# EAGLE design NU32 (EAGLE 5.12)
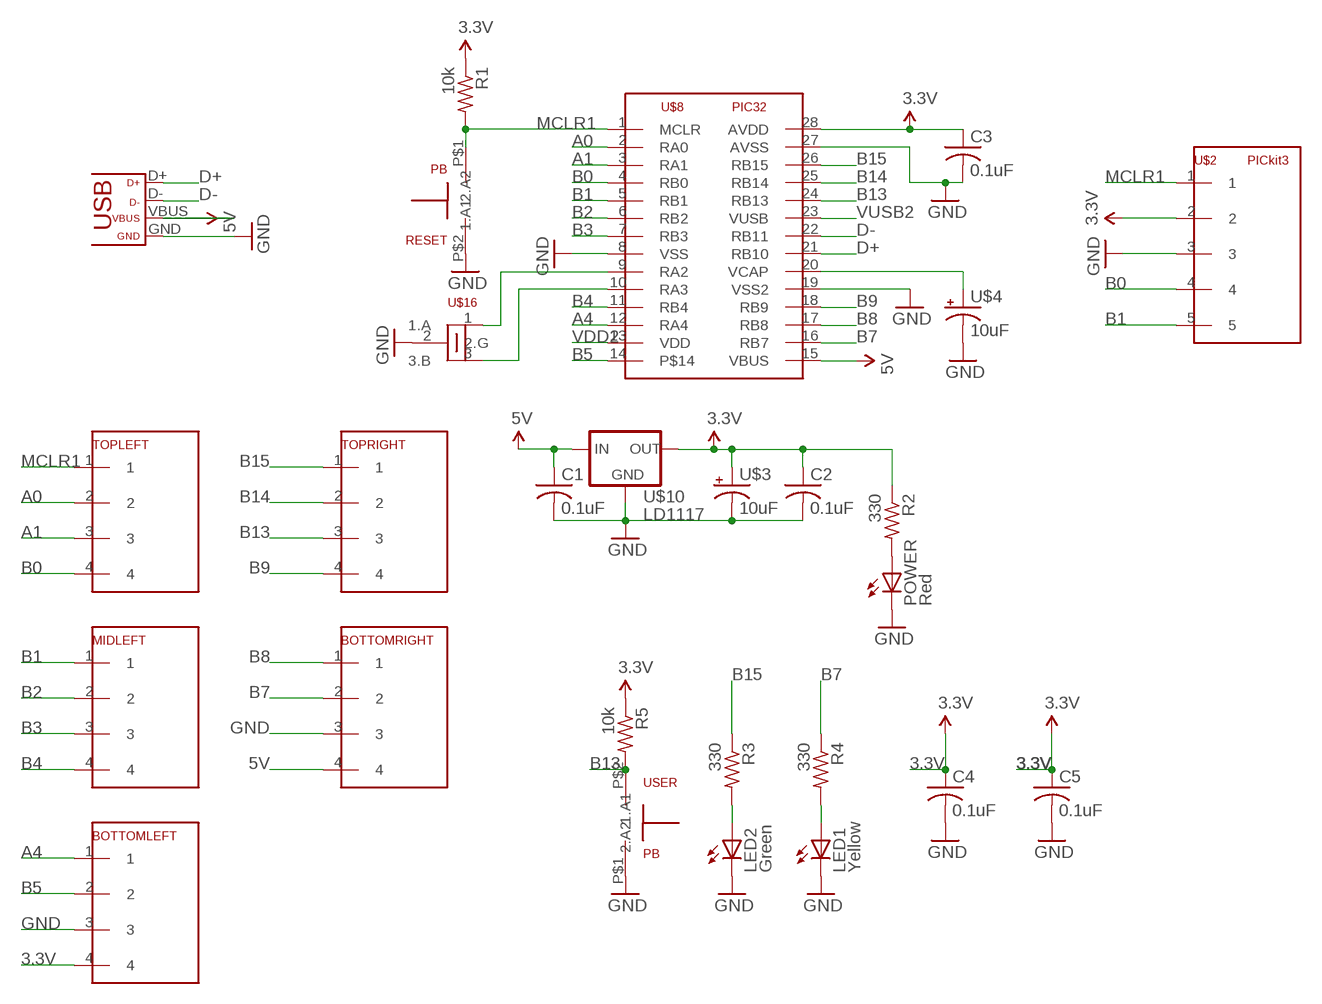
[diagram p0: schematic, sheet 1]

## Parts
BOTTOMLEFT  1X04_HEADER  [1X04]
BOTTOMRIGHT  1X04_HEADER  [1X04]
C1  0.1uF  C-US025-025X050  [C025-025X050]
C2  0.1uF  C-US025-025X050  [C025-025X050]
C3  0.1uF  C-US025-025X050  [C025-025X050]
C4  0.1uF  C-US025-025X050  [C025-025X050]
C5  0.1uF  C-US025-025X050  [C025-025X050]
LED1  Yellow  TLLY4400  [LED3MM]
LED2  Green  TLLG4400  [LED3MM]
MIDLEFT  1X04_HEADER  [1X04]
POWER  Red  TLLR4400  [LED3MM]
R1  10k  R-US_0309/12  [0309/12]
R2  330  R-US_0309/12  [0309/12]
R3  330  R-US_0309/12  [0309/12]
R4  330  R-US_0309/12  [0309/12]
R5  10k  R-US_0309/12  [0309/12]
RESET  PB  [PB]
TOPLEFT  1X04_HEADER  [1X04]
TOPRIGHT  1X04_HEADER  [1X04]
U$2  PICkit3  1X05_HEADER  [1X05]
U$3  10uF  CAP_POL  [CAP_POL_D]
U$4  10uF  CAP_POL  [CAP_POL_D]
U$8  PIC32  [DIL28-3]
U$10  LD1117  [TO220]
U$11  USB  [USB-MINIB]
U$16  8MHz  8MHZ  [1X03]
USER  PB  [PB]

## Nets
3.3V: BOTTOMLEFT.4 C3.1 C4.1 C5.1 R1.1 R5.1 U$2.2 U$8.28(AVDD)
5V: BOTTOMRIGHT.4 U$8.15(VBUS) U$11.VBUS
A0: TOPLEFT.2 U$8.2(RA0)
A1: TOPLEFT.3 U$8.3(RA1)
A4: BOTTOMLEFT.1 U$8.12(RA4)
B0: TOPLEFT.4 U$2.4 U$8.4(RB0)
B1: MIDLEFT.1 U$2.5 U$8.5(RB1)
B2: MIDLEFT.2 U$8.6(RB2)
B3: MIDLEFT.3 U$8.7(RB3)
B4: MIDLEFT.4 U$8.11(RB4)
B5: BOTTOMLEFT.2 U$8.14
B7: BOTTOMRIGHT.2 R4.1 U$8.16(RB7)
B8: BOTTOMRIGHT.1 U$8.17(RB8)
B9: TOPRIGHT.4 U$8.18(RB9)
B13: R5.2 TOPRIGHT.3 U$8.24(RB13) USER.P$2(2.A2)
B14: TOPRIGHT.2 U$8.25(RB14)
B15: R3.1 TOPRIGHT.1 U$8.26(RB15)
C1: C1.1 U$10.3(IN) ; supply symbol labelled 5V
C2: C2.1 R2.1 U$3.1(+) U$10.2(OUT) ; supply symbol labelled 3.3V
D+: U$8.21(RB10) U$11.D+
D-: U$8.22(RB11) U$11.D-
GND: BOTTOMLEFT.3 BOTTOMRIGHT.3 C1.2 C2.2 C3.2 C4.2 C5.2 LED1.K(C) LED2.K(C) POWER.K(C) RESET.P$2(2.A2) U$2.3 U$3.2(-) U$4.2(-) U$8.8(VSS) U$8.19(VSS2) U$8.27(AVSS) U$10.1(GND) U$11.GND U$16.2(2.G) USER.P$1(1.A1)
MCLR1: R1.2 RESET.P$1(1.A1) TOPLEFT.1 U$2.1
N$1: U$8.9(RA2) U$16.1(1.A)
N$2: POWER.A R2.2
N$3: U$8.10(RA3) U$16.3(3.B)
N$4: LED2.A R3.2
N$5: LED1.A R4.2
N$21: U$4.1(+) U$8.20(VCAP)
VDD2: U$8.13(VDD)
VUSB2: U$8.23(VUSB)
Unconnected: U$8.1(MCLR)

## Library data of the parts
BOTTOMLEFT BOTTOMRIGHT MIDLEFT TOPLEFT TOPRIGHT = ME433:1X04_HEADER
C1-C5 = resistor:C-US: CAPACITOR, American symbol
LED1 = ME433Felz:TLLY4400: Low Current (2mA) LED 3 mm Tinted Diffused Package color YELLOW Source: Data sheet <http://www.farnell.com/datasheets/391098.pdf>; MF: VISHAY SEMICONDUCTOR; OC_FARNELL: 1612439
LED2 = ME433Felz:TLLG4400: Low Current (2mA) LED 3 mm Tinted Diffused Package color GREEN Source: Data sheet <http://www.farnell.com/datasheets/391098.pdf>; MF: VISHAY SEMICONDUCTOR; OC_FARNELL: 1612435
POWER = ME433Felz:TLLR4400: Low Current (2mA) LED 3 mm Tinted Diffused Package color RED Source: Data sheet <http://www.farnell.com/datasheets/391100.pdf>; MF: VISHAY SEMICONDUCTOR; OC_FARNELL: 1612437
R1-R5 = resistor:R-US_: RESISTOR, American symbol
RESET USER = ME433Felz:PB
U$2 = ME433:1X05_HEADER
U$3 U$4 = ME433:CAP_POL
U$8 = ME433Felz:PIC32
U$10 = ME433:LD1117
U$11 = ME433:USB
U$16 = ME433Felz:8MHZ

## Board
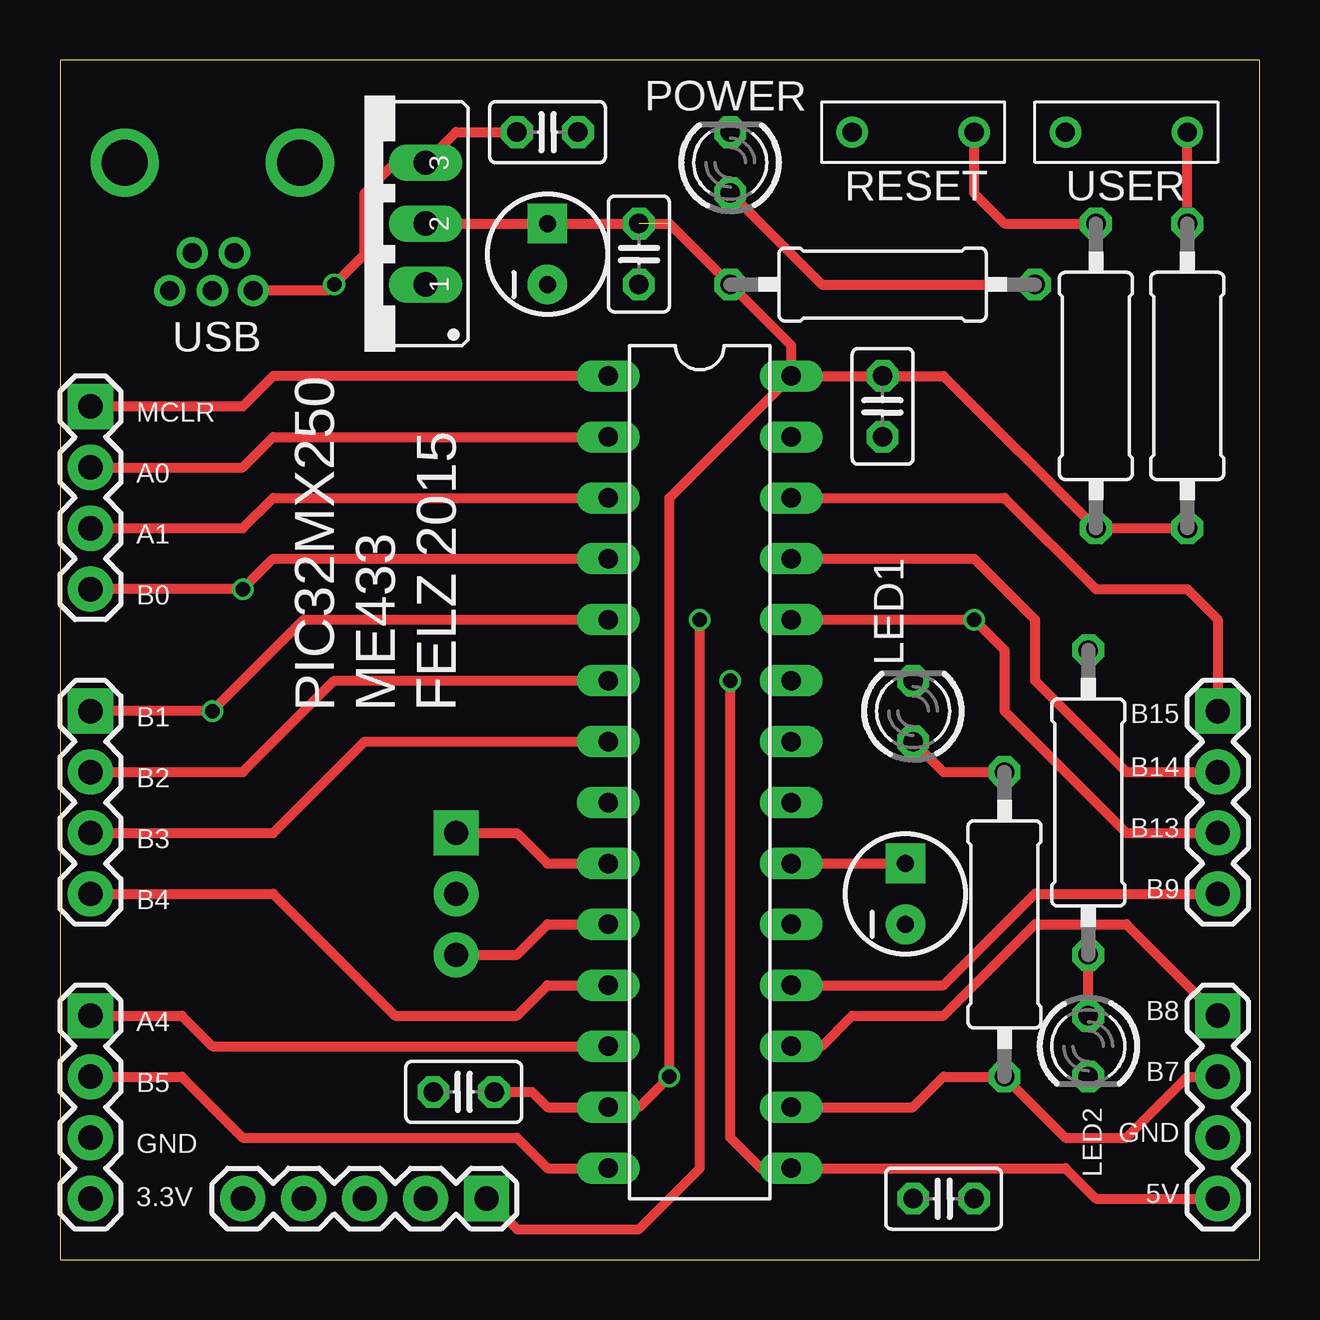
[diagram p1: board, top side]
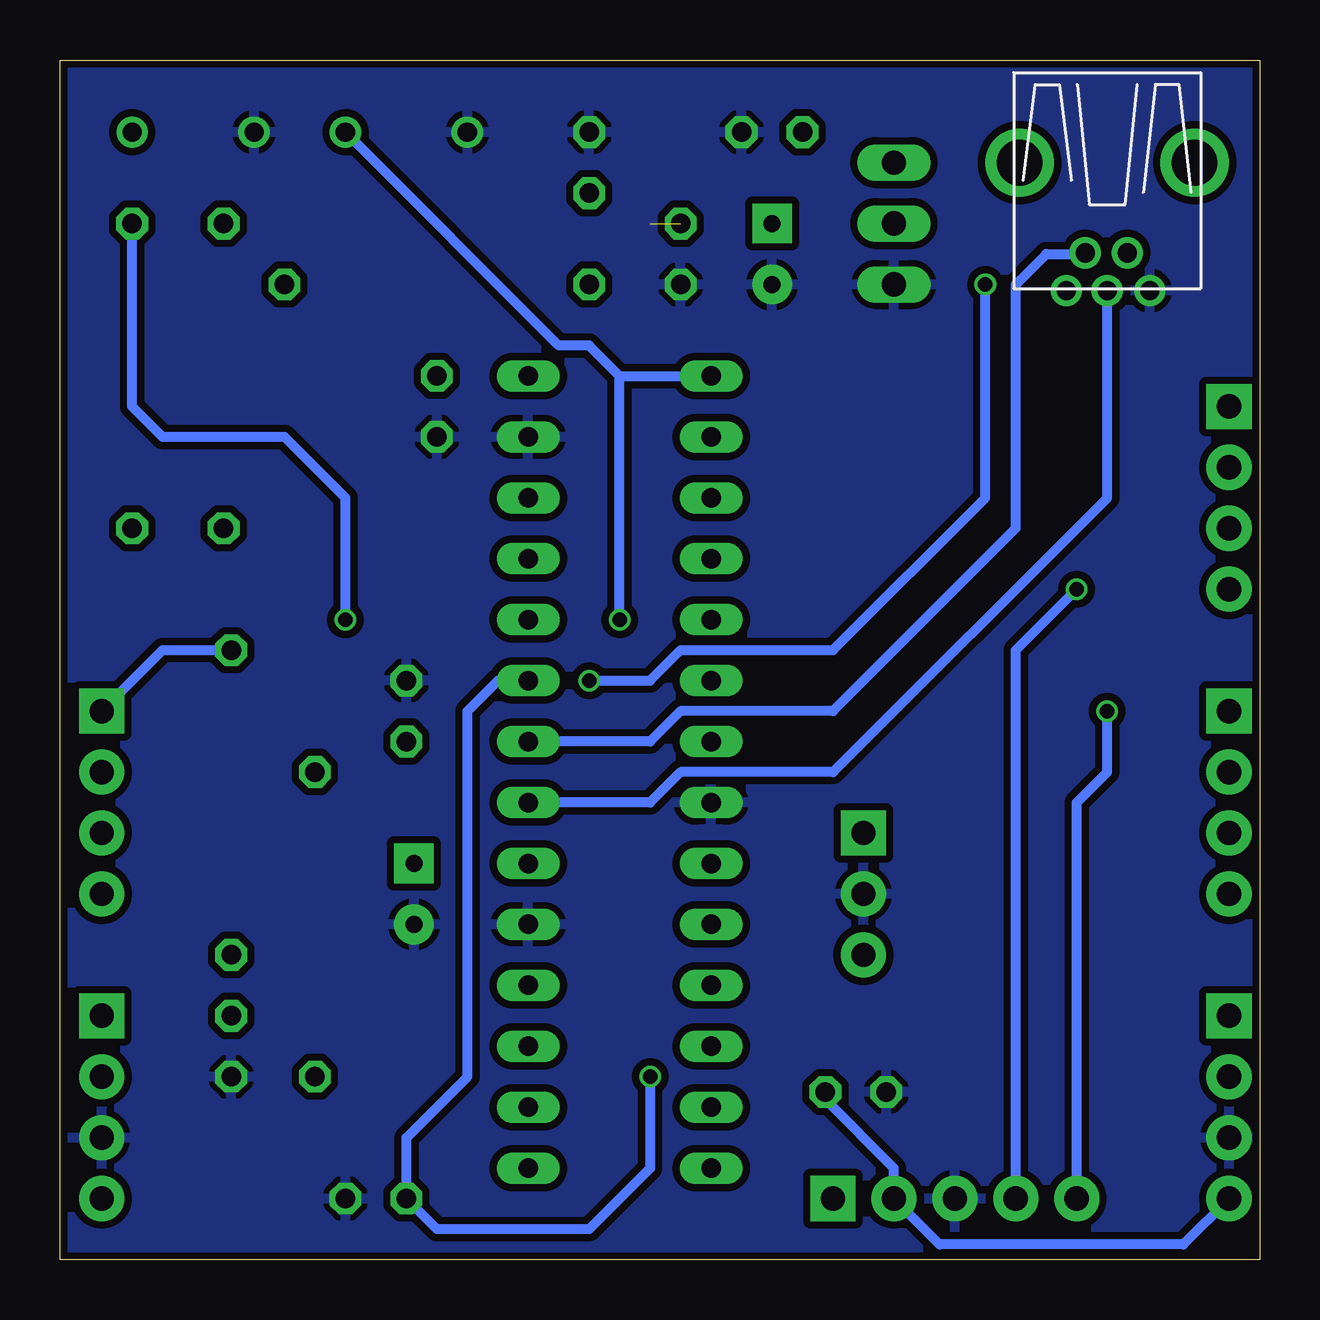
[diagram p2: board, bottom side, seen from below]

Size 50 x 50 mm. Coordinates in mm from the lower left corner, seen from the top.
Outline: 0,0 50,0 50,50 0,50 0,0
Copper layers (1*16): Top 0.035mm / dielectric 1.5mm / Bottom 0.035mm
Design rules "check": minimum track width 6mil, minimum drill 12mil, track to track 6mil, track to pad 6mil, pad to pad 6mil, via to via 6mil, smd to smd 0mil, copper to edge 10mil, drill to drill 10mil, minimum pad ring 10mil, minimum via ring 6mil, stop-mask expansion 2mil, vias tented up to drill 100mil, thermal gap 10mil

### Footprints (pad centres in the part's own frame; a part is rotated, then mirrored left to right if it is on the bottom)
1X04 = drill 1.016 pad 1.88 square: 1 0,0 | drill 1.016 pad 1.88 round: 2 2.54,0; 3 5.08,0; 4 7.62,0
C025-025X050 = drill 0.813 octagon: 1 -1.27,0; 2 1.27,0
LED3MM = drill 0.813 octagon: A -1.27,0; K 1.27,0
0309/12 = drill 0.813 octagon: 1 -6.35,0; 2 6.35,0
PB = drill 0.8 round: P$1 -2.54,0; P$2 2.54,0
1X05 = drill 1.016 pad 1.88 square: 1 0,0 | drill 1.016 pad 1.88 round: 2 2.54,0; 3 5.08,0; 4 7.62,0; 5 10.16,0
CAP_POL_D = drill 0.7 pad 1.651 square: 1 1.27,0 | drill 0.7 pad 1.651 round: 2 -1.27,0
DIL28-3 = drill 0.813 long: 1 -16.51,-3.81; 2 -13.97,-3.81; 3 -11.43,-3.81; 4 -8.89,-3.81; 5 -6.35,-3.81; 6 -3.81,-3.81; 7 -1.27,-3.81; 8 1.27,-3.81; 9 3.81,-3.81; 10 6.35,-3.81; 11 8.89,-3.81; 12 11.43,-3.81; 13 13.97,-3.81; 14 16.51,-3.81; 15 16.51,3.81; 16 13.97,3.81; 17 11.43,3.81; 18 8.89,3.81; 19 6.35,3.81; 20 3.81,3.81; 21 1.27,3.81; 22 -1.27,3.81; 23 -3.81,3.81; 24 -6.35,3.81; 25 -8.89,3.81; 26 -11.43,3.81; 27 -13.97,3.81; 28 -16.51,3.81
TO220 = drill 1.016 long: 1 -2.54,0; 2 0,0; 3 2.54,0
USB-MINIB = drill 0.8 round: D+ 4.064,0; D- 2.489,0.914; GND 4.064,-1.778; ID 2.489,-0.838; VBUS 4.064,1.702 | drill 1.9 round: P$6 -1.27,-3.65; P$7 -1.27,3.65
1X03 = drill 1.016 pad 1.88 square: 1 0,0 | drill 1.016 pad 1.88 round: 2 2.54,0; 3 5.08,0

### Placement (x,y rotation side)
BOTTOMLEFT  1.27,10.16 270 top
BOTTOMRIGHT  48.26,10.16 270 top
C1  20.32,46.99 0 top
C2  24.13,41.91 270 top
C3  34.29,35.56 270 top
C4  16.83,6.99 180 top
C5  36.83,2.54 0 top
LED1  35.56,22.86 90 top
LED2  42.86,8.89 270 top
MIDLEFT  1.27,22.86 270 top
POWER  27.94,45.72 90 top
R1  43.18,36.83 90 top
R2  34.29,40.64 0 top
R3  42.86,19.05 270 top
R4  39.37,13.97 90 top
R5  46.99,36.83 90 top
RESET  35.56,46.99 180 top
TOPLEFT  1.27,35.56 270 top
TOPRIGHT  48.26,22.86 270 top
U$2  17.78,2.54 180 top
U$3  20.32,41.91 90 top
U$4  35.24,15.24 90 top
U$8  26.67,20.32 270 top
U$10  15.24,43.18 90 top
U$11  6.35,44.45 270 top
U$16  16.51,17.78 270 top
USER  44.45,46.99 0 top

### Tracks (layer width: path | path; a pad name or v marks a point on that pad's centre or on a via)
3.3V  (via drill 0.6)
  Top 0.406: U$8.28 30.48,38.1 27.94,40.64 | U$8.28 C3.1 36.83,36.83 R1.1 R5.1 | C4.1 19.68,6.99 20.32,6.35 24.13,6.35 v25.4,7.62 25.4,31.75 U$8.28
  Bottom 0.406: C4.1 18.1,6.67 15.24,3.81 U$2.2 13.34,0.64 3.17,0.64 BOTTOMLEFT.4 | C5.1 34.29,1.27 27.94,1.27 25.4,3.81 v25.4,7.62
5V  (via drill 0.6)
  Top 0.406: U$11.VBUS 11.18,40.39 v11.43,40.64 12.7,41.91 12.7,44.45 13.97,45.72 15.24,45.72 16.51,46.99 19.05,46.99 | v27.94,24.13 27.94,5.08 29.21,3.81 U$8.15 41.91,3.81 43.18,2.54 BOTTOMRIGHT.4
  Bottom 0.406: v11.43,40.64 11.43,31.75 17.78,25.4 24.13,25.4 25.4,24.13 v27.94,24.13
A0
  Top 0.406: TOPLEFT.2 7.62,33.02 8.89,34.29 U$8.2
A1
  Top 0.406: TOPLEFT.3 7.62,30.48 8.89,31.75 U$8.3
A4
  Top 0.406: U$8.12 6.35,8.89 5.08,10.16 BOTTOMLEFT.1
B0  (via drill 0.6)
  Top 0.406: TOPLEFT.4 v7.62,27.94 8.89,29.21 U$8.4
  Bottom 0.406: v7.62,27.94 10.16,25.4 U$2.4
B1  (via drill 0.6)
  Top 0.406: MIDLEFT.1 v6.35,22.86 10.16,26.67 U$8.5
  Bottom 0.406: v6.35,22.86 6.35,20.32 7.62,19.05 U$2.5
B2
  Top 0.406: MIDLEFT.2 7.62,20.32 11.43,24.13 U$8.6
B3
  Top 0.406: MIDLEFT.3 8.89,17.78 12.7,21.59 U$8.7
B4
  Top 0.406: U$8.11 20.32,11.43 19.05,10.16 13.97,10.16 8.89,15.24 MIDLEFT.4
B5
  Top 0.406: U$8.14 20.32,3.81 19.05,5.08 7.62,5.08 5.08,7.62 BOTTOMLEFT.2
B7
  Top 0.406: U$8.16 35.56,6.35 36.83,7.62 R4.1 41.91,5.08 44.45,5.08 46.99,7.62 BOTTOMRIGHT.2
B8
  Top 0.406: U$8.17 31.75,8.89 33.02,10.16 36.83,10.16 40.64,13.97 44.45,13.97 BOTTOMRIGHT.1
B9
  Top 0.406: U$8.18 36.83,11.43 40.64,15.24 TOPRIGHT.4
B13  (via drill 0.6)
  Top 0.406: R5.2 USER.P$2 | TOPRIGHT.3 44.45,17.78 39.37,22.86 39.37,25.4 v38.1,26.67 U$8.24
  Bottom 0.406: R5.2 46.99,35.56 45.72,34.29 40.64,34.29 38.1,31.75 v38.1,26.67
B14
  Top 0.406: U$8.25 38.1,29.21 40.64,26.67 40.64,24.13 44.45,20.32 TOPRIGHT.2
B15
  Top 0.406: U$8.26 39.37,31.75 43.18,27.94 46.99,27.94 48.26,26.67 TOPRIGHT.1
  Bottom 0.406: R3.1 45.72,25.4 TOPRIGHT.1
C1
  Top 0.406: C1.1 16.51,46.99 U$10.3
C2  (1 unrouted)
  Top 0.406: U$10.2 U$3.1 25.4,43.18 R2.1
D+
  Bottom 0.406: U$8.21 25.4,19.05 24.13,20.32 17.78,20.32 6.35,31.75 U$11.D+
D-
  Bottom 0.406: U$8.22 25.4,21.59 24.13,22.86 17.78,22.86 10.16,30.48 10.16,40.64 8.89,41.91 7.32,41.91 U$11.D-
GND
  pour Bottom (isolate 0.305): 0,49.53 0,0 49.53,0 49.53,49.53
MCLR1  (via drill 0.6)
  Top 0.406: U$2.1 19.05,1.27 24.13,1.27 26.67,3.81 v26.67,26.67 | RESET.P$1 38.1,44.45 39.37,43.18 R1.2 | v22.86,36.83 8.89,36.83 7.62,35.56 TOPLEFT.1
  Bottom 0.406: RESET.P$1 29.21,38.1 27.94,38.1 26.67,36.83 | v26.67,26.67 26.67,36.83 | 26.67,36.83 v22.86,36.83
N$1
  Top 0.406: U$16.1 19.05,17.78 20.32,16.51 U$8.9
N$2
  Top 0.406: R2.2 31.75,40.64 POWER.A
N$3
  Top 0.406: U$16.3 19.05,12.7 20.32,13.97 U$8.10
N$4
  Top 0.406: LED2.A R3.2
N$5
  Top 0.406: R4.2 36.83,20.32 LED1.A
N$21
  Top 0.406: U$8.20 U$4.1
VUSB2
  Bottom 0.406: U$8.23 31.75,24.13 33.02,22.86 33.02,7.62 35.56,5.08 35.56,2.54

### Text on the board
tPlace: 3 | 2 | 1 | MCLR | A0 | A1 | B0 | PIC32MX250 | ME433 | FELZ 2015 | B15 | B1 | B14 | B2 | B13 | B3 | B9 | B4 | B8 | A4 | B7 | B5 | GND | GND | 5V | 3.3V